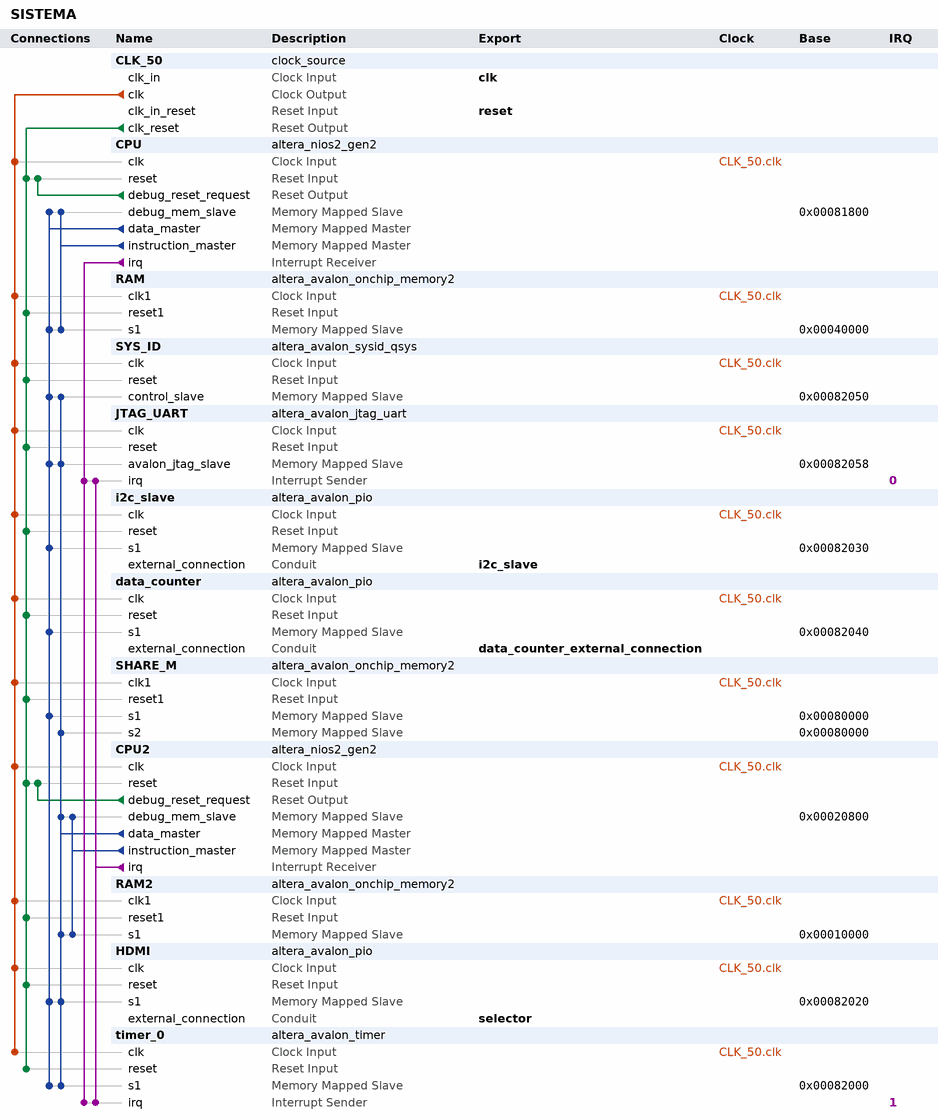
[diagram p0: system contents]
# Platform Designer (Qsys) system SISTEMA, Cyclone V 5CSEBA6U23I7DK
# Parameters at their usual value, and those the tool derives, are not listed.
package require -exact qsys 17.0
create_system SISTEMA
set_project_property DEVICE_FAMILY {Cyclone V}
set_project_property DEVICE 5CSEBA6U23I7DK

add_instance CLK_50 clock_source 17.0
set_instance_parameter_value CLK_50 clockFrequency 50000000

add_instance CPU altera_nios2_gen2 17.0
set_instance_parameter_value CPU dcache_size 2048
set_instance_parameter_value CPU exceptionSlave RAM.s1
set_instance_parameter_value CPU icache_size 4096
set_instance_parameter_value CPU impl Fast
set_instance_parameter_value CPU resetSlave RAM.s1
set_instance_parameter_value CPU setting_activateTrace true

add_instance RAM altera_avalon_onchip_memory2 17.0
set_instance_parameter_value RAM dataWidth 32
set_instance_parameter_value RAM dualPort false
set_instance_parameter_value RAM initMemContent true
set_instance_parameter_value RAM initializationFileName onchip_mem.hex
set_instance_parameter_value RAM memorySize 160000

add_instance SYS_ID altera_avalon_sysid_qsys 17.0
set_instance_parameter_value SYS_ID id 0

add_instance JTAG_UART altera_avalon_jtag_uart 17.0
set_instance_parameter_value JTAG_UART simInteractiveOptions NO_INTERACTIVE_WINDOWS

add_instance i2c_slave altera_avalon_pio 17.0
set_instance_parameter_value i2c_slave direction Input
set_instance_parameter_value i2c_slave width 8

add_instance data_counter altera_avalon_pio 17.0
set_instance_parameter_value data_counter direction Input
set_instance_parameter_value data_counter width 13

add_instance SHARE_M altera_avalon_onchip_memory2 17.0
set_instance_parameter_value SHARE_M dataWidth 32
set_instance_parameter_value SHARE_M dualPort true
set_instance_parameter_value SHARE_M initMemContent true
set_instance_parameter_value SHARE_M initializationFileName onchip_mem.hex
set_instance_parameter_value SHARE_M memorySize 4096
set_instance_parameter_value SHARE_M singleClockOperation true

add_instance CPU2 altera_nios2_gen2 17.0
set_instance_parameter_value CPU2 dcache_size 2048
set_instance_parameter_value CPU2 exceptionSlave RAM2.s1
set_instance_parameter_value CPU2 icache_size 4096
set_instance_parameter_value CPU2 impl Tiny
set_instance_parameter_value CPU2 resetSlave RAM2.s1

add_instance RAM2 altera_avalon_onchip_memory2 17.0
set_instance_parameter_value RAM2 dataWidth 32
set_instance_parameter_value RAM2 dualPort false
set_instance_parameter_value RAM2 initMemContent true
set_instance_parameter_value RAM2 initializationFileName onchip_mem.hex
set_instance_parameter_value RAM2 memorySize 65536

add_instance HDMI altera_avalon_pio 17.0
set_instance_parameter_value HDMI direction Output
set_instance_parameter_value HDMI width 3

add_instance timer_0 altera_avalon_timer 17.0
set_instance_parameter_value timer_0 period 1
set_instance_parameter_value timer_0 periodUnits MSEC

# connections
add_connection CLK_50.clk CPU2.clk clock
add_connection CLK_50.clk CPU.clk clock
add_connection CLK_50.clk data_counter.clk clock
add_connection CLK_50.clk HDMI.clk clock
add_connection CLK_50.clk i2c_slave.clk clock
add_connection CLK_50.clk JTAG_UART.clk clock
add_connection CLK_50.clk RAM2.clk1 clock
add_connection CLK_50.clk RAM.clk1 clock
add_connection CLK_50.clk SHARE_M.clk1 clock
add_connection CLK_50.clk SYS_ID.clk clock
add_connection CLK_50.clk timer_0.clk clock
add_connection CLK_50.clk_reset CPU2.reset reset
add_connection CLK_50.clk_reset CPU.reset reset
add_connection CLK_50.clk_reset data_counter.reset reset
add_connection CLK_50.clk_reset HDMI.reset reset
add_connection CLK_50.clk_reset i2c_slave.reset reset
add_connection CLK_50.clk_reset JTAG_UART.reset reset
add_connection CLK_50.clk_reset RAM2.reset1 reset
add_connection CLK_50.clk_reset RAM.reset1 reset
add_connection CLK_50.clk_reset SHARE_M.reset1 reset
add_connection CLK_50.clk_reset SYS_ID.reset reset
add_connection CLK_50.clk_reset timer_0.reset reset
add_connection CPU2.debug_reset_request CPU2.reset reset
add_connection CPU.debug_reset_request CPU.reset reset
add_connection CPU2.data_master CPU2.debug_mem_slave avalon
set_connection_parameter_value CPU2.data_master/CPU2.debug_mem_slave baseAddress 0x00020800
add_connection CPU2.data_master HDMI.s1 avalon
set_connection_parameter_value CPU2.data_master/HDMI.s1 baseAddress 0x00082020
add_connection CPU2.data_master JTAG_UART.avalon_jtag_slave avalon
set_connection_parameter_value CPU2.data_master/JTAG_UART.avalon_jtag_slave baseAddress 0x00082058
add_connection CPU2.data_master RAM2.s1 avalon
set_connection_parameter_value CPU2.data_master/RAM2.s1 baseAddress 0x00010000
add_connection CPU2.data_master SHARE_M.s2 avalon
set_connection_parameter_value CPU2.data_master/SHARE_M.s2 baseAddress 0x00080000
add_connection CPU2.data_master SYS_ID.control_slave avalon
set_connection_parameter_value CPU2.data_master/SYS_ID.control_slave baseAddress 0x00082050
add_connection CPU2.data_master timer_0.s1 avalon
set_connection_parameter_value CPU2.data_master/timer_0.s1 baseAddress 0x00082000
add_connection CPU2.instruction_master CPU2.debug_mem_slave avalon
set_connection_parameter_value CPU2.instruction_master/CPU2.debug_mem_slave baseAddress 0x00020800
add_connection CPU2.instruction_master RAM2.s1 avalon
set_connection_parameter_value CPU2.instruction_master/RAM2.s1 baseAddress 0x00010000
add_connection CPU.data_master CPU.debug_mem_slave avalon
set_connection_parameter_value CPU.data_master/CPU.debug_mem_slave baseAddress 0x00081800
add_connection CPU.data_master data_counter.s1 avalon
set_connection_parameter_value CPU.data_master/data_counter.s1 baseAddress 0x00082040
add_connection CPU.data_master HDMI.s1 avalon
set_connection_parameter_value CPU.data_master/HDMI.s1 baseAddress 0x00082020
add_connection CPU.data_master i2c_slave.s1 avalon
set_connection_parameter_value CPU.data_master/i2c_slave.s1 baseAddress 0x00082030
add_connection CPU.data_master JTAG_UART.avalon_jtag_slave avalon
set_connection_parameter_value CPU.data_master/JTAG_UART.avalon_jtag_slave baseAddress 0x00082058
add_connection CPU.data_master RAM.s1 avalon
set_connection_parameter_value CPU.data_master/RAM.s1 baseAddress 0x00040000
add_connection CPU.data_master SHARE_M.s1 avalon
set_connection_parameter_value CPU.data_master/SHARE_M.s1 baseAddress 0x00080000
add_connection CPU.data_master SYS_ID.control_slave avalon
set_connection_parameter_value CPU.data_master/SYS_ID.control_slave baseAddress 0x00082050
add_connection CPU.data_master timer_0.s1 avalon
set_connection_parameter_value CPU.data_master/timer_0.s1 baseAddress 0x00082000
add_connection CPU.instruction_master CPU.debug_mem_slave avalon
set_connection_parameter_value CPU.instruction_master/CPU.debug_mem_slave baseAddress 0x00081800
add_connection CPU.instruction_master RAM.s1 avalon
set_connection_parameter_value CPU.instruction_master/RAM.s1 baseAddress 0x00040000
add_connection CPU2.irq JTAG_UART.irq interrupt
set_connection_parameter_value CPU2.irq/JTAG_UART.irq irqNumber 0
add_connection CPU2.irq timer_0.irq interrupt
set_connection_parameter_value CPU2.irq/timer_0.irq irqNumber 1
add_connection CPU.irq JTAG_UART.irq interrupt
set_connection_parameter_value CPU.irq/JTAG_UART.irq irqNumber 0
add_connection CPU.irq timer_0.irq interrupt
set_connection_parameter_value CPU.irq/timer_0.irq irqNumber 1

# exported interfaces
add_interface clk clock sink
set_interface_property clk EXPORT_OF CLK_50.clk_in
add_interface data_counter_external_connection conduit end
set_interface_property data_counter_external_connection EXPORT_OF data_counter.external_connection
add_interface i2c_slave conduit end
set_interface_property i2c_slave EXPORT_OF i2c_slave.external_connection
add_interface reset reset sink
set_interface_property reset EXPORT_OF CLK_50.clk_in_reset
add_interface selector conduit end
set_interface_property selector EXPORT_OF HDMI.external_connection

set_interconnect_requirement {$system} qsys_mm.clockCrossingAdapter HANDSHAKE
set_interconnect_requirement {$system} qsys_mm.maxAdditionalLatency 1

save_system SISTEMA.qsys
